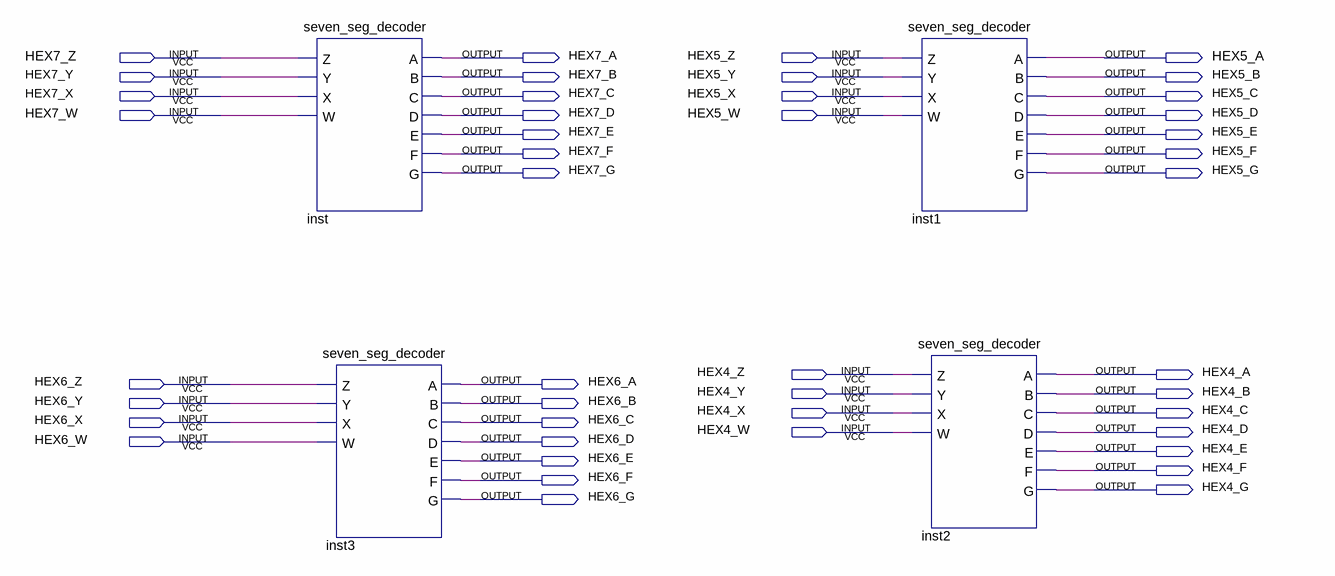
[diagram p0: schematic sheet]
// Quartus schematic lab5step1.bdf as structural Verilog: 4 symbols, 44 pins
module lab5step1 (
  input  HEX7_Z,
  input  HEX5_Z,
  input  HEX7_Y,
  input  HEX5_Y,
  input  HEX7_X,
  input  HEX5_X,
  input  HEX7_W,
  input  HEX5_W,
  input  HEX4_Z,
  input  HEX6_Z,
  input  HEX4_Y,
  input  HEX6_Y,
  input  HEX4_X,
  input  HEX6_X,
  input  HEX4_W,
  input  HEX6_W,
  output HEX7_A,
  output HEX5_A,
  output HEX7_B,
  output HEX5_B,
  output HEX7_C,
  output HEX5_C,
  output HEX7_D,
  output HEX5_D,
  output HEX7_E,
  output HEX5_E,
  output HEX7_F,
  output HEX5_F,
  output HEX7_G,
  output HEX5_G,
  output HEX4_A,
  output HEX6_A,
  output HEX4_B,
  output HEX6_B,
  output HEX4_C,
  output HEX6_C,
  output HEX4_D,
  output HEX6_D,
  output HEX4_E,
  output HEX6_E,
  output HEX4_F,
  output HEX6_F,
  output HEX4_G,
  output HEX6_G
);

  seven_seg_decoder inst (
    .Z(HEX7_Z), .Y(HEX7_Y), .X(HEX7_X), .W(HEX7_W), .A(HEX7_A), .B(HEX7_B), .C(HEX7_C), .D(HEX7_D),
    .E(HEX7_E), .F(HEX7_F), .G(HEX7_G));
  seven_seg_decoder inst3 (
    .Z(HEX6_Z), .Y(HEX6_Y), .X(HEX6_X), .W(HEX6_W), .A(HEX6_A), .B(HEX6_B), .C(HEX6_C), .D(HEX6_D),
    .E(HEX6_E), .F(HEX6_F), .G(HEX6_G));
  seven_seg_decoder inst1 (
    .Z(HEX5_Z), .Y(HEX5_Y), .X(HEX5_X), .W(HEX5_W), .A(HEX5_A), .B(HEX5_B), .C(HEX5_C), .D(HEX5_D),
    .E(HEX5_E), .F(HEX5_F), .G(HEX5_G));
  seven_seg_decoder inst2 (
    .Z(HEX4_Z), .Y(HEX4_Y), .X(HEX4_X), .W(HEX4_W), .A(HEX4_A), .B(HEX4_B), .C(HEX4_C), .D(HEX4_D),
    .E(HEX4_E), .F(HEX4_F), .G(HEX4_G));
endmodule
